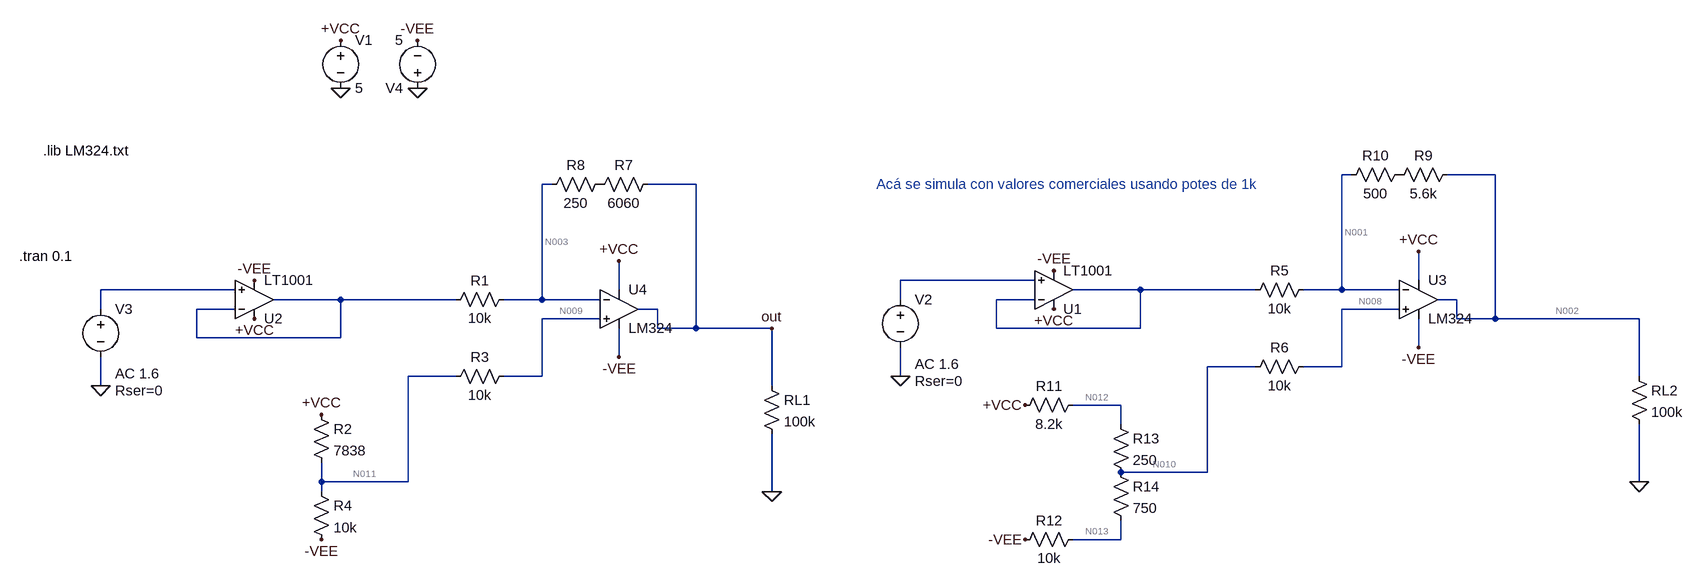
[diagram p0: schematic amplificador_dac.asc]
amplificador_dac.asc, the LTspice schematic file:
Version 4
SHEET 1 2452 980
WIRE 1888 -112 1872 -112
WIRE 2128 -112 2048 -112
WIRE 0 -96 -16 -96
WIRE 240 -96 160 -96
WIRE 1360 64 1136 64
WIRE 2000 64 2000 16
WIRE -528 80 -752 80
WIRE 112 80 112 32
WIRE 1536 80 1424 80
WIRE 1728 80 1536 80
WIRE 1872 80 1872 -112
WIRE 1872 80 1808 80
WIRE 1968 80 1872 80
WIRE -352 96 -464 96
WIRE -160 96 -352 96
WIRE -16 96 -16 -96
WIRE -16 96 -80 96
WIRE 80 96 -16 96
WIRE 1136 96 1136 64
WIRE 1360 96 1296 96
WIRE 2064 96 2032 96
WIRE -752 112 -752 80
WIRE -528 112 -592 112
WIRE 176 112 144 112
WIRE 1968 112 1872 112
WIRE 80 128 -16 128
WIRE 2064 128 2064 96
WIRE 2128 128 2128 -112
WIRE 2128 128 2064 128
WIRE 2368 128 2128 128
WIRE 176 144 176 112
WIRE 240 144 240 -96
WIRE 240 144 176 144
WIRE 480 144 240 144
WIRE 1296 144 1296 96
WIRE 1536 144 1536 80
WIRE 1536 144 1296 144
WIRE -592 160 -592 112
WIRE -352 160 -352 96
WIRE -352 160 -592 160
WIRE 2000 176 2000 128
WIRE 112 192 112 144
WIRE 1728 208 1648 208
WIRE 1872 208 1872 112
WIRE 1872 208 1808 208
WIRE -160 224 -240 224
WIRE -16 224 -16 128
WIRE -16 224 -80 224
WIRE 1136 224 1136 176
WIRE 2368 224 2368 128
WIRE -752 240 -752 192
WIRE 480 240 480 144
WIRE 1504 272 1424 272
WIRE 1504 304 1504 272
WIRE 1648 384 1648 208
WIRE 1648 384 1504 384
WIRE -384 400 -384 368
WIRE -240 400 -240 224
WIRE -240 400 -384 400
WIRE 2368 400 2368 304
WIRE -384 416 -384 400
WIRE 480 416 480 320
WIRE 1504 496 1504 464
WIRE 1504 496 1424 496
FLAG 112 32 +VCC
FLAG -352 -256 0
FLAG -352 -336 +VCC
FLAG -752 240 0
FLAG -224 -256 0
FLAG -224 -336 -VEE
FLAG 112 192 -VEE
FLAG -496 128 +VCC
FLAG -496 64 -VEE
FLAG 480 416 0
FLAG 480 144 out
FLAG -384 288 +VCC
FLAG -384 496 -VEE
FLAG 2000 16 +VCC
FLAG 1136 224 0
FLAG 2000 176 -VEE
FLAG 1392 112 +VCC
FLAG 1392 48 -VEE
FLAG 2368 400 0
FLAG 1344 272 +VCC
FLAG 1344 496 -VEE
SYMBOL voltage -352 -352 R0
WINDOW 123 0 0 Left 2
WINDOW 39 0 0 Left 2
SYMATTR InstName V1
SYMATTR Value 5
SYMBOL voltage -752 96 R0
WINDOW 123 24 124 Left 2
WINDOW 39 24 152 Left 2
WINDOW 3 24 96 Invisible 2
SYMATTR Value2 AC 1.6
SYMATTR SpiceLine Rser=0
SYMATTR Value PWL TIME_SCALE_FACTOR=0.1 VALUE_SCALE_FACTOR=1 REPEAT FOREVER (file=triangularDAC_0a3.2V_256pts.txt) ENDREPEAT
SYMATTR InstName V3
SYMBOL res -64 80 R90
WINDOW 0 0 56 VBottom 2
WINDOW 3 32 56 VTop 2
SYMATTR InstName R1
SYMATTR Value 10k
SYMBOL voltage -224 -240 R180
WINDOW 123 0 0 Left 2
WINDOW 39 0 0 Left 2
SYMATTR InstName V4
SYMATTR Value 5
SYMBOL Opamps\\LT1001 -496 160 M180
SYMATTR InstName U2
SYMBOL Opamps\\opamp2 112 48 R0
SYMATTR InstName U4
SYMATTR Value LM324
SYMBOL res 464 224 R0
SYMATTR InstName RL1
SYMATTR Value 100k
SYMBOL res -64 208 R90
WINDOW 0 0 56 VBottom 2
WINDOW 3 32 56 VTop 2
SYMATTR InstName R3
SYMATTR Value 10k
SYMBOL res 176 -112 R90
WINDOW 0 0 56 VBottom 2
WINDOW 3 32 56 VTop 2
SYMATTR InstName R7
SYMATTR Value 6060
SYMBOL res 96 -112 R90
WINDOW 0 0 56 VBottom 2
WINDOW 3 32 56 VTop 2
SYMATTR InstName R8
SYMATTR Value 250
SYMBOL res -400 272 R0
SYMATTR InstName R2
SYMATTR Value 7838
SYMBOL res -400 400 R0
SYMATTR InstName R4
SYMATTR Value 10k
SYMBOL voltage 1136 80 R0
WINDOW 123 24 124 Left 2
WINDOW 39 24 152 Left 2
WINDOW 3 24 96 Invisible 2
SYMATTR Value2 AC 1.6
SYMATTR SpiceLine Rser=0
SYMATTR Value PWL TIME_SCALE_FACTOR=0.1 VALUE_SCALE_FACTOR=1 REPEAT FOREVER (file=triangularDAC_0a3.2V_256pts.txt) ENDREPEAT
SYMATTR InstName V2
SYMBOL res 1824 64 R90
WINDOW 0 0 56 VBottom 2
WINDOW 3 32 56 VTop 2
SYMATTR InstName R5
SYMATTR Value 10k
SYMBOL Opamps\\LT1001 1392 144 M180
SYMATTR InstName U1
SYMBOL Opamps\\opamp2 2000 32 R0
SYMATTR InstName U3
SYMATTR Value LM324
SYMBOL res 2352 208 R0
SYMATTR InstName RL2
SYMATTR Value 100k
SYMBOL res 1824 192 R90
WINDOW 0 0 56 VBottom 2
WINDOW 3 32 56 VTop 2
SYMATTR InstName R6
SYMATTR Value 10k
SYMBOL res 2064 -128 R90
WINDOW 0 0 56 VBottom 2
WINDOW 3 32 56 VTop 2
SYMATTR InstName R9
SYMATTR Value 5.6k
SYMBOL res 1984 -128 R90
WINDOW 0 0 56 VBottom 2
WINDOW 3 32 56 VTop 2
SYMATTR InstName R10
SYMATTR Value 500
SYMBOL res 1440 256 R90
WINDOW 0 0 56 VBottom 2
WINDOW 3 32 56 VTop 2
SYMATTR InstName R11
SYMATTR Value 8.2k
SYMBOL res 1440 480 R90
WINDOW 0 0 56 VBottom 2
WINDOW 3 32 56 VTop 2
SYMATTR InstName R12
SYMATTR Value 10k
SYMBOL res 1488 288 R0
SYMATTR InstName R13
SYMATTR Value 250
SYMBOL res 1488 368 R0
SYMATTR InstName R14
SYMATTR Value 750
TEXT -888 24 Left 2 !.tran 0.1
TEXT -848 -152 Left 2 !.lib LM324.txt
TEXT 1096 -96 Left 2 ;Acá se simula con valores comerciales usando potes de 1k

The netlist it stands for:
* amplificador_dac.asc
V1 +VCC 0 5
V3 N005 0 PWL TIME_SCALE_FACTOR=0.1 VALUE_SCALE_FACTOR=1 REPEAT FOREVER (file=triangularDAC_0a3.2V_256pts.txt) ENDREPEAT AC 1.6 Rser=0
R1 N003 N007 10k
V4 0 -VEE 5
XU2 N005 N007 +VCC -VEE N007 LT1001  ; pins In+ In- V+ V- OUT
XU4 N009 N003 +VCC -VEE out LM324  ; pins In+ In- V+ V- OUT
RL1 out 0 100k
R3 N009 N011 10k
R7 out P001 6060
R8 P001 N003 250
R2 +VCC N011 7838
R4 N011 -VEE 10k
V2 N004 0 PWL TIME_SCALE_FACTOR=0.1 VALUE_SCALE_FACTOR=1 REPEAT FOREVER (file=triangularDAC_0a3.2V_256pts.txt) ENDREPEAT AC 1.6 Rser=0
R5 N001 N006 10k
XU1 N004 N006 +VCC -VEE N006 LT1001  ; pins In+ In- V+ V- OUT
XU3 N008 N001 +VCC -VEE N002 LM324  ; pins In+ In- V+ V- OUT
RL2 N002 0 100k
R6 N008 N010 10k
R9 N002 P002 5.6k
R10 P002 N001 500
R11 N012 +VCC 8.2k
R12 N013 -VEE 10k
R13 N012 N010 250
R14 N010 N013 750
.tran 0.1
.lib LM324.txt
* Acá se simula con valores comerciales usando potes de 1k
.lib LTC.lib
.backanno
.end

* Results of the author's LTspice run, read from the files saved beside the schematic
* Operating Point, zero values left out:
*   V(+vcc) = 5 V
*   V(n003) = 606.2 mV
*   V(-vee) = -5 V
*   V(out) = 988.6 mV
*   V(n009) = 606.3 mV
*   V(n011) = 606.1 mV
*   V(p001) = 621.4 mV
*   V(n001) = 599.2 mV
*   V(n002) = 964.5 mV
*   V(n008) = 599.3 mV
*   V(n010) = 599.1 mV
*   V(p002) = 629.1 mV
*   V(n012) = 729.3 mV
*   V(n013) = 208.4 mV
*   I(R14) = 520.8 µA
*   I(R13) = 520.8 µA
*   I(R12) = 520.8 µA
*   I(R11) = -520.8 µA
*   I(R10) = 59.9 µA
*   I(R9) = 59.9 µA
*   I(R6) = 19.86 nA
*   I(Rl2) = 9.645 µA
*   I(R5) = 59.92 µA
*   I(R4) = 560.6 µA
*   I(R2) = 560.6 µA
*   I(R8) = 60.6 µA
*   I(R7) = 60.6 µA
*   I(R3) = 19.86 nA
*   I(Rl1) = 9.886 µA
*   I(R1) = 60.62 µA
*   I(V4) = -6.322 mA
*   I(V1) = -6.201 mA